# Altium project kuzgun.PrjPcb
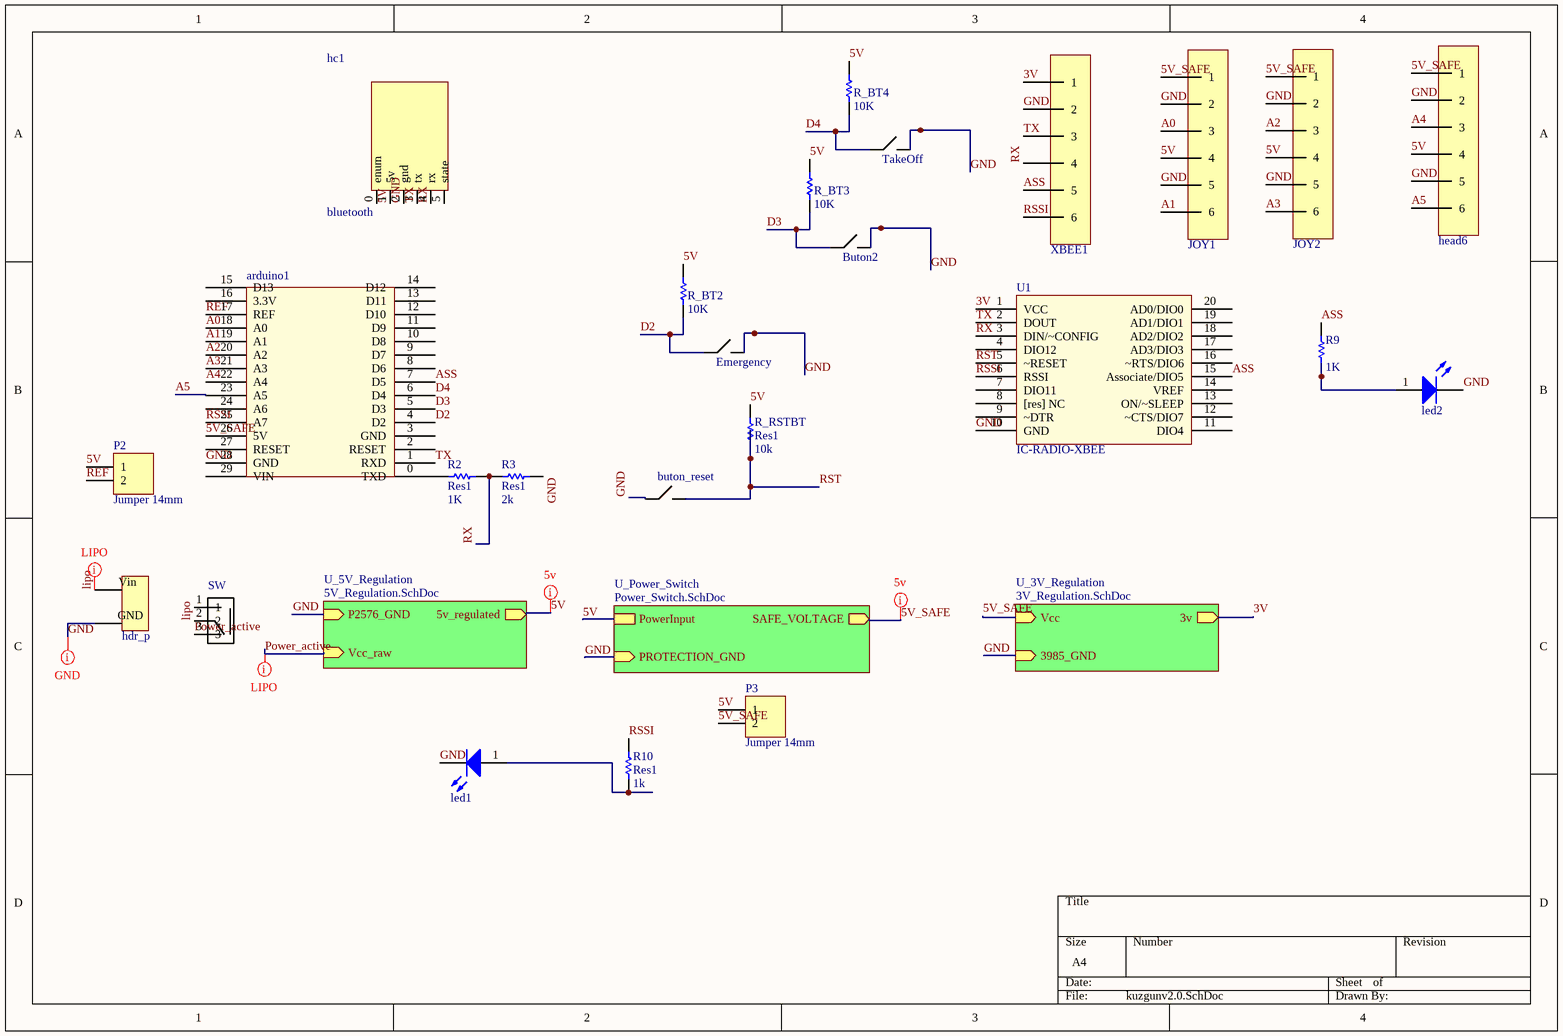
[diagram p0: kuzgunv2.0.SchDoc]
4 sheets, 57 parts. Net scope: hierarchical (ports join the sheet entries above them; power ports are global).
Board files: kuzgunv0.5.PcbDoc, kuzgun2.0.PcbDoc
Sheets:
  kuzgunv2.0.SchDoc
    U_3V_Regulation = 3V_Regulation.SchDoc
    U_Power_Switch = Power_Switch.SchDoc
    U_5V_Regulation = 5V_Regulation.SchDoc

## Sheet kuzgunv2.0.SchDoc
size A4

### Parts
arduino1  arduinoNano  [Arduino nano]  (value not drawn)
Buton2  buton  [4pin_smd]  (value not drawn)
buton_reset  buton  [4pin_smd]  (value not drawn)
Emergency  buton  [4pin_smd]  (value not drawn)
hc1  bluetooth  [hc05]
hdr_p  header_2_power  [HDR2_POWER]  (value not drawn)
head6  header_6  [hdr_6pin]  (value not drawn)
JOY1  header_6  [hdr_6pin]  (value not drawn)
JOY2  header_6  [hdr_6pin]  (value not drawn)
led1  L_green  [Led_green]  (value not drawn)
led2  L_green  [Led_green]  (value not drawn)
P2  Jumper 14mm  [jumper2pin_1.27]
P3  Jumper 14mm  [jumper2pin_1.27]
R1  R_BT4  value 10K  [led]
R2  Res1  value 1K  [led]
R3  Res1  value 2k  [led]
R4  R_BT3  value 10K  [led]
R5  R_BT2  value 10K  [led]
R9  value 1K  [led]  (hidden comment: Res1)
R10  Res1  value 1k  [led]
R_RSTBT  Res1  value 10k  [led]
SW  Master_S  [SW]  (value not drawn)
TakeOff  buton  [4pin_smd]  (value not drawn)
U1  IC-RADIO-XBEE  [XBee Standard]
XBEE1  header_6  [hdr6_1.27]  (value not drawn)

### Sub-sheets
U_3V_Regulation = 3V_Regulation.SchDoc: Vcc (in), 3v (out), 3985_GND (in)
U_5V_Regulation = 5V_Regulation.SchDoc: 5v_regulated (out), P2576_GND (in), Vcc_raw (in)
U_Power_Switch = Power_Switch.SchDoc: PowerInput, SAFE_VOLTAGE (out), PROTECTION_GND (in)

### Nets
GND: arduino1.28(GND) Buton2.2 buton_reset.1 Emergency.2 hc1.2(gnd) hdr_p.GND head6.2 head6.5 JOY1.2 JOY1.5 JOY2.2 JOY2.5 led1.2(K) led2.2(K) R3.1 TakeOff.2 U1.10(GND) XBEE1.2 ; sheet U_3V_Regulation/3985_GND, sheet U_Power_Switch/PROTECTION_GND, sheet U_5V_Regulation/P2576_GND
3V: U1.1(VCC) XBEE1.1 ; sheet U_3V_Regulation/3v
5V: hc1.1(5v) head6.4 JOY1.4 JOY2.4 P2.1 P3.1 R1.2 R4.2 R5.2 R_RSTBT.2 ; sheet U_Power_Switch/PowerInput, sheet U_5V_Regulation/5v_regulated
5V_SAFE: arduino1.26(5V) head6.1 JOY1.1 JOY2.1 P3.2 ; sheet U_3V_Regulation/Vcc, sheet U_Power_Switch/SAFE_VOLTAGE
A0: arduino1.18(A0) JOY1.3
A1: arduino1.19(A1) JOY1.6
A2: arduino1.20(A2) JOY2.3
A3: arduino1.21(A3) JOY2.6
A4: arduino1.22(A4) head6.3
A5: arduino1.23(A5) head6.6
ASS: arduino1.7(D5) R9.2 U1.15(Associate/DIO5) XBEE1.5
D2: arduino1.4(D2) Emergency.1 R5.1
D3: arduino1.5(D3) Buton2.1 R4.1
D4: arduino1.6(D4) R1.1 TakeOff.1
lipo: hdr_p.Vin SW.2
Power_active: SW.3 ; sheet U_5V_Regulation/Vcc_raw
REF: arduino1.17(REF) P2.2
RSSI: arduino1.25(A7) R10.2 U1.6(RSSI) XBEE1.6
RST: buton_reset.2 R_RSTBT.1 U1.5(~RESET)
RX: hc1.4(rx) R2.2 R3.2 U1.3(DIN/~CONFIG) XBEE1.4
TX: arduino1.1(RXD) hc1.3(tx) U1.2(DOUT) XBEE1.3
Netarduino1_0: arduino1.0(TXD) R2.1
Netled1_1: led1.1(V) R10.1
Netled2_1: led2.1(V) R9.1

Not connected (* = marked no-connect by the designer): arduino1 2(RESET) 3(GND) 8(D6) 9(D7) 10(D8) 11(D9) 12(D10) 13(D11) 14(D12) 15(D13) 16(3.3V) 24(A6) 27(RESET) 29(VIN); hc1 0(enum) 5(state); SW 1; U1 4(DIO12) 7(DIO11) 8([res]_NC) 9(~DTR) 11(DIO4) 12(~CTS/DIO7) 13(ON/~SLEEP) 14(VREF) 16(~RTS/DIO6) 17(AD3/DIO3) 18(AD2/DIO2) 19(AD1/DIO1) 20(AD0/DIO0)

### Layout directives
net class 5V; rule Width Constraint [Pref Width = 30mil    Min Width = 30mil    Max Width = 30mil]: lipo, Power_active
net class Undefined: GND
net class 5V; rule Width Constraint [Pref Width = 25mil    Min Width = 25mil    Max Width = 30mil]: 5V, 5V_SAFE

### Library data of the parts
hc1 = hc05: bluetooth device hc 05
R1-R5 R9 R10 R_RSTBT = Res1: Resistor; Published: 8-Jun-2000; LatestRevisionDate: 17-Jul-2002; LatestRevisionNote: Re-released for DXP Platform.; PackageReference: AXIAL-0.3; Publisher: Altium Limited; PackageDescription: Axial Device, Thru-Hole; 2 Leads; 0.3 in Pin Spacing
SW = Master_S: Switch Slide ON ON SPDT Top Slide 0.1A 12VDC 10000Cycles PC Pins Thru-Hole Bulk; MF: C&K Components; Package: DO-201 C&amp;K Components; Price: 0.29 USD; SnapEDA_Link: https://www.snapeda.com/parts/OS102011MS2QN1/C%26K%20Components/view-part/?ref=snap; Availability: Good; Value: *
U1 = IC-RADIO-XBEE: CONN XBEE TH
P2 P3 = Jumper 14mm: LatestRevisionDate: 17-Jul-2002; LatestRevisionNote: Re-released for DXP Platform.; Publisher: Altium Limited

## Sheet 3V_Regulation.SchDoc
size A1
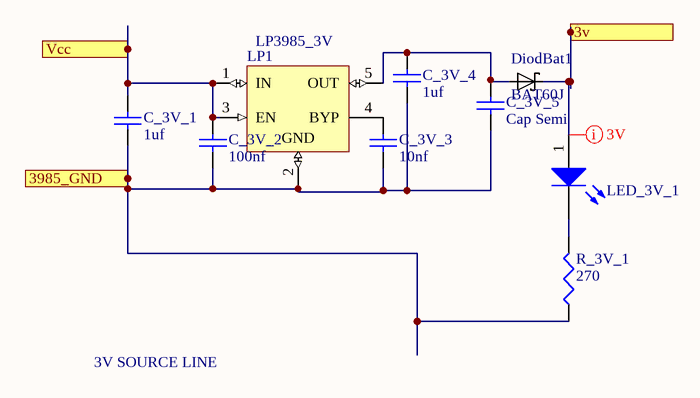
[diagram p1: 3V_Regulation.SchDoc]

### Parts
C_3V_1  1uf  [1608(0603)]
C_3V_2  100nf  [1608(0603)]
C_3V_3  10nf  [1608(0603)]
C_3V_4  1uf  [1608(0603)]
C_3V_5  Cap Semi  [1608(0603)]
DiodBat1  BAT60J  [*SOD323_ST_BAT60J(Primary)]
LED_3V_1  L_green  [LED_0603]  (value not drawn)
LP1  LP3985_3V  [*SOT95P280X145-5N]
R_3V_1  value 270  [1608(0603)]  (hidden comment: Res3)

### Ports
3v (out), 3985_GND (in), Vcc (in)

### Nets
GND: C_3V_1.1 C_3V_2.1 C_3V_3.1 C_3V_4.1 C_3V_5.1 LP1.2(GND) R_3V_1.1 ; port 3985_GND
3V: DiodBat1.C LED_3V_1.1(V) ; port 3v
5V_SAFE: C_3V_1.2 C_3V_2.2 LP1.1(IN) LP1.3(EN) ; port Vcc
NetC_3V_3_2: C_3V_3.2 LP1.4(BYP)
NetC_3V_4_2: C_3V_4.2 C_3V_5.2 DiodBat1.A LP1.5(OUT)
NetLED_3V_1_2: LED_3V_1.2(K) R_3V_1.2

### Layout directives
net class GND; rule Routing Layers [TopLayer - Enabled BottomLayer - Enabled ]; rule Width Constraint [Pref Width = 10mil    Min Width = 10mil    Max Width = 10mil]: 3V

### Notes on the sheet
- 3V SOURCE LINE

### Library data of the parts
C_3V_1-C_3V_5 = Cap Semi: Capacitor (Semiconductor SIM Model); Value: 100pF; Published: 8-Jun-2000; LatestRevisionDate: 29-May-2009; LatestRevisionNote: IPC-7351 Footprint Added.; PackageReference: C1206; Publisher: Altium Limited; PackageDescription: Chip Capacitor
DiodBat1 = BAT60J: MF: STMicroelectronics; Package: None; MP: BAT60J; SnapEDA_Link: https://www.snapeda.com/parts/BAT60J/STMicroelectronics/view-part/?ref=snap; Availability: Unavailable; Price: None; Value: *
LP1 = LP3985IM5-2.9: Micropower, 150mA Low-Noise Ultra Low-Dropout CMOS Voltage Regulator, 5-pin SOT-23; Manufacturer: National Semiconductor; PackageTopMarking: LCYB*XTT; PowerWise: N; CompType: LDO IC; PinCount: 5; DatasheetVersion: Aug-2005; PackageVersion: revD, Aug-2008; PackageReference: MF05A; PackageDescription: Molded SOT-23, .115 x .063 x .040 in Body, 5 Lead, .0375 in Pitch; RoHS: Y; PartNumber: LP3985IM5-2.9
R_3V_1 = Res3: Resistor; Published: 8-Jun-2000; LatestRevisionDate: 29-May-2009; LatestRevisionNote: IPC-7351 Footprint Added.; PackageReference: J1-0603; Publisher: Altium Limited; PackageDescription: Chip Resistor

## Sheet Power_Switch.SchDoc
size A1
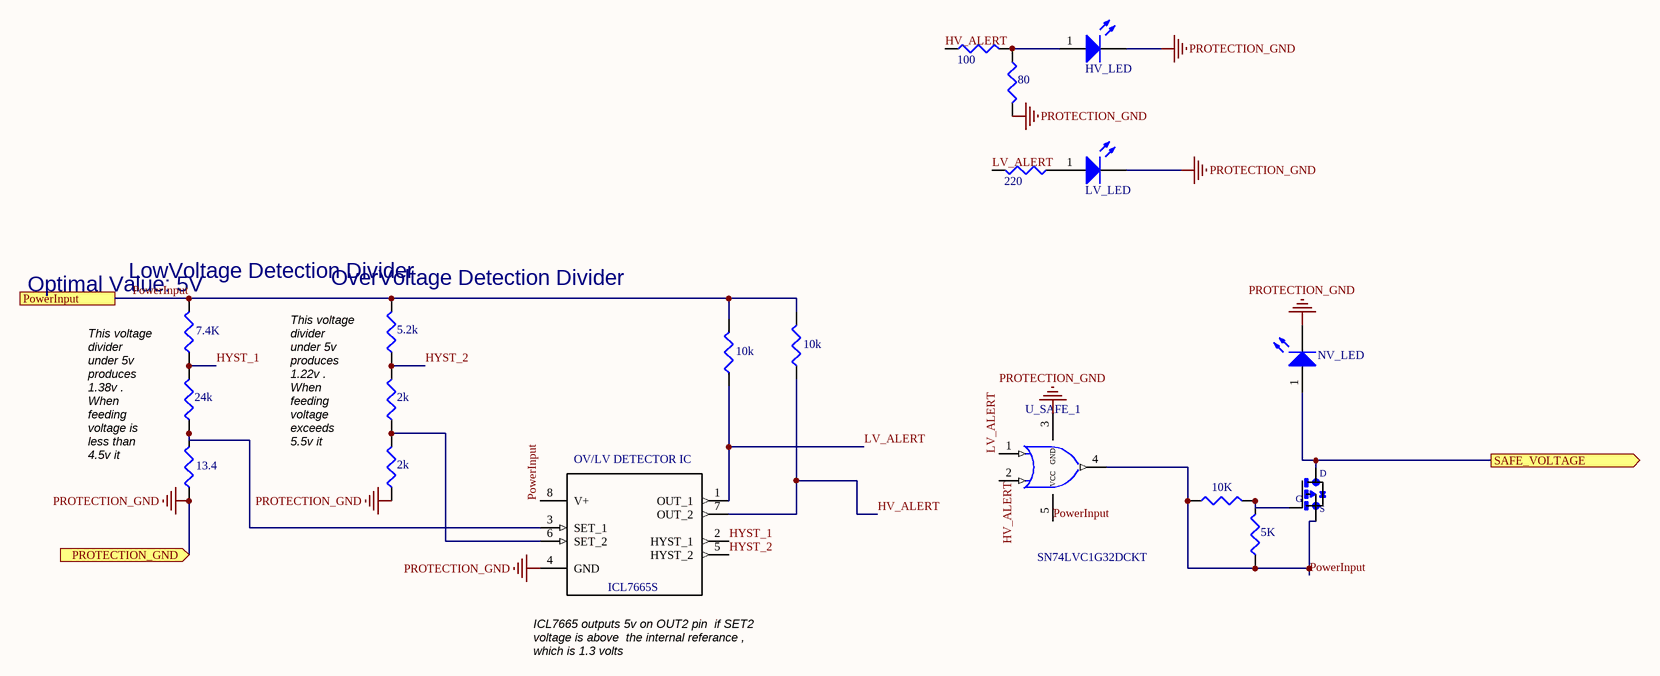
[diagram p2: Power_Switch.SchDoc]

### Parts
HV_LED  L_green  [LED_0603]  (value not drawn)
LV_LED  L_green  [LED_0603]  (value not drawn)
MOS_SAFE_1  SI2323DS-T1-GE3  [*SOT23]  (value not drawn)
NV_LED  L_green  [LED_0603]  (value not drawn)
OV/LV_DETECTOR_IC  ICL7665S  [*SOIC127P600X175-8N]
R_SAFE_10  value 10K  [1608(0603)]  (hidden comment: Res3)
R_SAFE_11  value 5K  [1608(0603)]  (hidden comment: Res3)
RHV1  value 5.2k  [1608(0603)]  (hidden comment: Res3)
RHV2  value 2k  [1608(0603)]  (hidden comment: Res3)
RHV3  value 2k  [1608(0603)]  (hidden comment: Res3)
RHV_ALERT1  value 100  [1608(0603)]  (hidden comment: Res3)
RHV_ALERT2  value 80  [1608(0603)]  (hidden comment: Res3)
RICL_OUT2  value 10k  [1608(0603)]  (hidden comment: Res3)
RICLOUT1  value 10k  [1608(0603)]  (hidden comment: Res3)
RLV1  value 7.4K  [1608(0603)]  (hidden comment: Res3)
RLV2  value 24k  [1608(0603)]  (hidden comment: Res3)
RLV3  value 13.4  [1608(0603)]  (hidden comment: Res3)
RLV_ALERT1  value 220  [1608(0603)]  (hidden comment: Res3)
U_SAFE_1  SN74LVC1G32DCKT  [*SOT65P210X110-5N]

### Ports
PowerInput, PROTECTION_GND (in), SAFE_VOLTAGE (out)

### Nets
PROTECTION_GND: HV_LED.2(K) LV_LED.2(K) NV_LED.2(K) OV/LV_DETECTOR_IC.4(GND) RHV3.1 RHV_ALERT2.2 RLV3.1 U_SAFE_1.3(GND) ; port PROTECTION_GND  [project net GND]
5V_SAFE: MOS_SAFE_1.3(D) NV_LED.1(V) ; port SAFE_VOLTAGE
HV_ALERT: OV/LV_DETECTOR_IC.7(OUT_2) RHV_ALERT1.1 RICL_OUT2.1 U_SAFE_1.2
HYST_1: OV/LV_DETECTOR_IC.2(HYST_1) RLV1.1 RLV2.2
HYST_2: OV/LV_DETECTOR_IC.5(HYST_2) RHV1.1 RHV2.2
LV_ALERT: OV/LV_DETECTOR_IC.1(OUT_1) RICLOUT1.1 RLV_ALERT1.2 U_SAFE_1.1(A)
PowerInput: MOS_SAFE_1.2(S) OV/LV_DETECTOR_IC.8(V+) R_SAFE_10.1 R_SAFE_11.1 RHV1.2 RICL_OUT2.2 RICLOUT1.2 RLV1.2 U_SAFE_1.4(Y) U_SAFE_1.5(VCC) ; port PowerInput  [project net 5V]
NetHV_LED_1: HV_LED.1(V) RHV_ALERT1.2 RHV_ALERT2.1
NetLV_LED_1: LV_LED.1(V) RLV_ALERT1.1
NetMOS_SAFE_1_1: MOS_SAFE_1.1(G) R_SAFE_10.2 R_SAFE_11.2
NetOV/LV_DETECTOR_IC_3: OV/LV_DETECTOR_IC.3(SET_1) RLV2.1 RLV3.2
NetOV/LV_DETECTOR_IC_6: OV/LV_DETECTOR_IC.6(SET_2) RHV2.1 RHV3.2

### Notes on the sheet
- (near RLV1) Optimal Value: 5V
- LowVoltage Detection Divider
- (near RHV1) OverVoltage Detection Divider
- This voltage divider under 5v produces 1.38v .          When feeding voltage is less than 4.5v it produces 1.25v
- This voltage divider under 5v produces 1.22v .          When feeding voltage exceeds 5.5v it produces 1.35v.
- (near OV/LV_DETECTOR_IC) ICL7665 outputs 5v on OUT2 pin  if SET2 voltage is above  the internal referance , which is 1.3 volts

### Library data of the parts
MOS_SAFE_1 = PMOS: Single P-Channel 20 V 0.039 O 19 nC Surface Mount Power Mosfet - SOT-23; MF: Vishay; MP: SI2323DS-T1-GE3; Availability: Unavailable; SnapEDA_Link: https://www.snapeda.com/parts/SI2323DS-T1-GE3/Vishay%20Siliconix/view-part/?ref=snap; Package: SOT-23-3 Vishay; Price: None; Value: *
OV/LV_DETECTOR_IC = ICL7665SCBAZA-T: CMOS Micropower Over/Under Voltage Detector; MF: Renesas Electronics; Package: SOIC-8 Intersil; Digi-Key_Purchase_URL: https://www.digikey.com.tr/product-detail/en/renesas-electronics-america-inc/ICL7665SCBAZA-T/ICL7665SCBAZA-TTR-ND/1034561?utm_source=snapeda&utm_medium=aggregator&utm_campaign=symbol; MP: ICL7665SCBAZA-T; Digi-Key_Part_Number: ICL7665SCBAZA-TTR-ND; SnapEDA_Link: https://www.snapeda.com/parts/ICL7665SCBAZA-T/Renesas%20Electronics%20America%20Inc./view-part/?ref=snap; Value: *
R_SAFE_10 R_SAFE_11 RHV1-RHV3 RHV_ALERT1 RHV_ALERT2 RICL_OUT2 RICLOUT1 RLV1-RLV3 RLV_ALERT1 = Res3: Resistor; Published: 8-Jun-2000; LatestRevisionDate: 29-May-2009; LatestRevisionNote: IPC-7351 Footprint Added.; PackageReference: J1-0603; Publisher: Altium Limited; PackageDescription: Chip Resistor
U_SAFE_1 = SN74LVC1: Single 2-Input Positive-O Gate 5-SC70 -40 to 125; MF: Texas Instruments; SnapEDA_Link: https://www.snapeda.com/parts/SN74LVC1G32DCKT/Texas%20Instruments/view-part/?ref=snap; Price: None; Package: SC-70-5 Texas Instruments; Availability: Unavailable; MP: SN74LVC1G32DCKT; Value: *

## Sheet 5V_Regulation.SchDoc
size A1
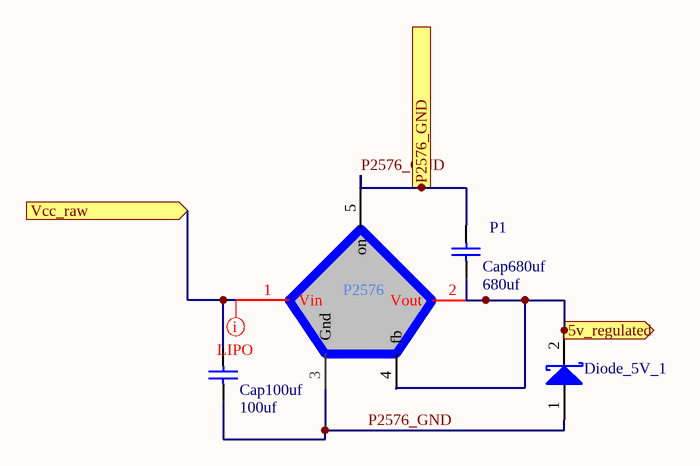
[diagram p3: 5V_Regulation.SchDoc]

### Parts
C_5V_1  Cap680uf  value 680uf  [Cap_small]
C_5V_2  Cap100uf  value 100uf  [Cap_small]
Diode_5V_1  D Schottky  [SCHOTKY_PMEG6_SOD128]  (value not drawn)
P1  P2576  [P2576]  (value not drawn)

### Ports
5v_regulated (out), P2576_GND (in), Vcc_raw (in)

### Nets
P2576_GND: C_5V_1.2 C_5V_2.1 Diode_5V_1.1(A) P1.3(Gnd) P1.5(on) ; port P2576_GND  [project net GND]
5V: C_5V_1.1 Diode_5V_1.2(K) P1.2(Vout) P1.4(fb) ; port 5v_regulated
Power_active: C_5V_2.2 P1.1(Vin) ; port Vcc_raw

### Layout directives
net class LIPO; rule Routing Layers [TopLayer - Enabled BottomLayer - Enabled ]; rule Width Constraint [Pref Width = 35mil    Min Width = 35mil    Max Width = 40mil]: Power_active

### Library data of the parts
C_5V_1 C_5V_2 = Cap: Capacitor; Published: 8-Jun-2000; LatestRevisionDate: 17-Jul-2002; LatestRevisionNote: Re-released for DXP Platform.; PackageReference: RAD-0.3; Publisher: Altium Limited; PackageDescription: Radial Cap, Thru-Hole; 2 Leads; 0.3 in Pin Spacing
Diode_5V_1 = D Schottky: Schottky Diode; Published: 8-Jun-2000; LatestRevisionDate: 17-Jul-2002; LatestRevisionNote: Re-released for DXP Platform.; PackageReference: SMB; Publisher: Altium Limited; PackageDescription: DO-214-AA/SMB; 2 C-Bend Leads; Body 5.3 x 3.6 mm, inc. leads (LxW); Code_JEDEC: DO-214-AA
P1 = P2576L-12-TA5

## Nets that join several sheets
GND: kuzgunv2.0 (18 pins), 3V_Regulation (7 pins), Power_Switch (8 pins), 5V_Regulation (5 pins)
3V: kuzgunv2.0 (U1.1 XBEE1.1), 3V_Regulation (DiodBat1.C LED_3V_1.1)
5V: kuzgunv2.0 (10 pins), Power_Switch (10 pins), 5V_Regulation (C_5V_1.1 Diode_5V_1.2 P1.2 P1.4)
5V_SAFE: kuzgunv2.0 (5 pins), 3V_Regulation (C_3V_1.2 C_3V_2.2 LP1.1 LP1.3), Power_Switch (MOS_SAFE_1.3 NV_LED.1)
Power_active: kuzgunv2.0 (SW.3), 5V_Regulation (C_5V_2.2 P1.1)